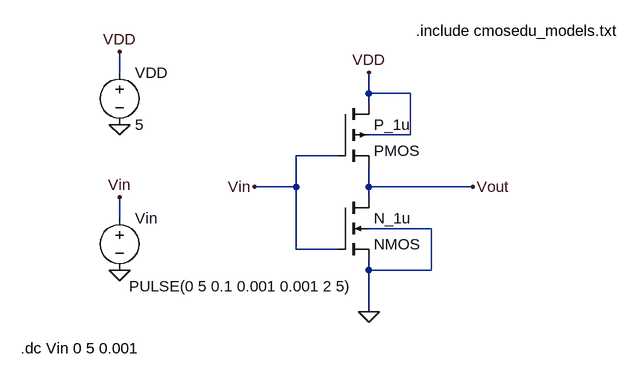
[diagram p0: schematic NOT.asc]
NOT.asc, the LTspice schematic file:
Version 4
SHEET 1 880 680
WIRE -224 32 -224 0
WIRE 160 64 160 32
WIRE 224 64 160 64
WIRE 160 80 160 64
WIRE 224 128 224 64
WIRE 224 128 160 128
WIRE 112 160 48 160
WIRE 48 208 48 160
WIRE 48 208 -16 208
WIRE 160 208 160 176
WIRE 320 208 160 208
WIRE 160 224 160 208
WIRE -224 256 -224 224
WIRE 256 272 160 272
WIRE 48 304 48 208
WIRE 112 304 48 304
WIRE 160 336 160 320
WIRE 256 336 256 272
WIRE 256 336 160 336
WIRE 160 400 160 336
FLAG 160 400 0
FLAG 160 32 VDD
FLAG 320 208 Vout
FLAG -16 208 Vin
FLAG -224 0 VDD
FLAG -224 224 Vin
FLAG -224 112 0
FLAG -224 336 0
SYMBOL pmos4 112 80 R0
SYMATTR InstName P_1u
SYMBOL nmos4 112 224 R0
SYMATTR InstName N_1u
SYMBOL voltage -224 16 R0
SYMATTR InstName VDD
SYMATTR Value 5
SYMBOL voltage -224 240 R0
WINDOW 3 15 121 Left 2
WINDOW 123 0 0 Left 0
WINDOW 39 0 0 Left 0
SYMATTR Value PULSE(0 5 0.1 0.001 0.001 2 5)
SYMATTR InstName Vin
TEXT 232 -32 Left 2 !.include cmosedu_models.txt
TEXT -376 456 Left 2 !.dc Vin 0 5 0.001

The netlist it stands for:
* NOT.asc
M§P_1u VDD Vin Vout VDD PMOS
M§N_1u Vout Vin 0 0 NMOS
VDD VDD 0 5
Vin Vin 0 PULSE(0 5 0.1 0.001 0.001 2 5)
.model NMOS NMOS
.model PMOS PMOS
.lib standard.mos
.include cmosedu_models.txt
.dc Vin 0 5 0.001
.backanno
.end